# Altium schematic sheet Analog.SchDoc
size A4
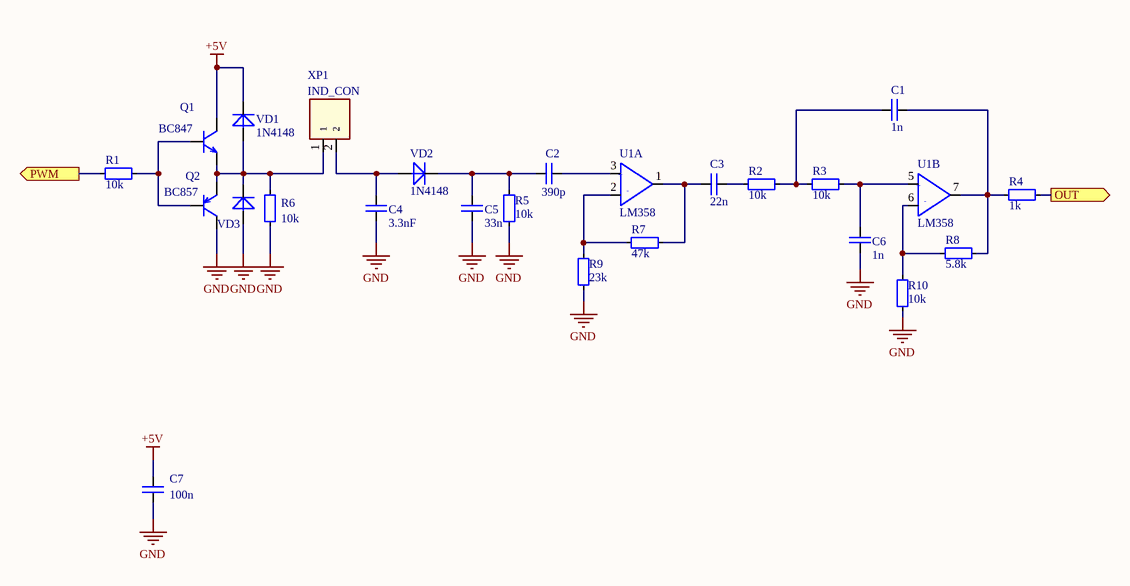
[diagram p0: Analog.SchDoc]

## Parts
C1  1n  [SMD_0805]
C2  390p  [SMD_0805]
C3  22n  [SMD_0805]
C4  3.3nF  [SMD_0805]
C5  33n  [SMD_0805]
C6  1n  [SMD_0805]
C7  100n  [SMD_0805]
Q1  BC847  [SOT23-3PIN]
Q2  BC857  [SOT23-3PIN]
R1  10k  [SMD_1206]
R2  10k  [SMD_0805]
R3  10k  [SMD_0805]
R4  1k  [SMD_1206]
R5  10k  [SMD_0805]
R6  10k  [SMD_0805]
R7  47k  [SMD_0805]
R8  5.8k  [SMD_0805]
R9  23k  [SMD_0805]
R10  10k  [SMD_0805]
U1  LM358  [SO8-150mil]  (parts A,B of 2)
VD1  1N4148  [DIO-MELF_SOD-80]
VD2  1N4148  [DIO-MELF_SOD-80]
VD3  1N4148  [DIO-MELF_SOD-80]  (value not drawn)
XP1  IND_CON  [PIN-HEAD-1/2/2.54]

## Ports
OUT (out), PWM (out)

## Nets
+5V: C7.2 Q1.3(C) U1.8(VCC) VD1.1(C)
GND: C4.1 C5.1 C6.1 C7.1 Q2.3(C) R5.2 R6.2 R9.2 R10.2 U1.4(GND) VD3.2(A)
OUT: R4.1 ; port OUT
PWM: R1.1 ; port PWM
NetC1_1: C1.1 R2.1 R3.2
NetC1_2: C1.2 R4.2 R8.1 U1.7
NetC2_1: C2.1 C5.2 R5.1 VD2.1(C)
NetC2_2: C2.2 U1.3
NetC3_1: C3.1 R7.1 U1.1
NetC3_2: C3.2 R2.2
NetC4_2: C4.2 VD2.2(A) XP1.2
NetC6_2: C6.2 R3.1 U1.5
NetQ1_1: Q1.1(B) Q2.1(B) R1.2
NetQ1_2: Q1.2(E) Q2.2(E) R6.1 VD1.2(A) VD3.1(C) XP1.1
NetR7_2: R7.2 R9.1 U1.2
NetR8_2: R8.2 R10.1 U1.6

## Notes on the sheet
- (in symbol LM358, part A) +; -
- (in symbol LM358, part B) +; -

## Library data of the parts
C1-C7 = C_NONE_POLAR: None polar capacitor; Case: 0805
  C1 C6: Value: 1n
  C2: Value: 390p
  C3: Value: 22n
  C4: Value: 3.3nF
  C5: Value: 33n
  C7: Value: 100n
Q1 = BC847: NPN; Manufacture: NXP; Model: BC847; Case: SOT-23; HelpURL: https://assets.nexperia.com/documents/data-sheet/BC847_SER.pdf
Q2 = BC857: PNP; Manufacture: NXP; Model: BC857; Case: SOT-23; HelpURL: https://assets.nexperia.com/documents/data-sheet/BC856_BC857_BC858.pdf
R1-R10 = RES: Resistor; Case: 0805
  R1-R3 R5 R6 R10: Value: 10k
  R4: Value: 1k
  R7: Value: 47k
  R8: Value: 5.8k
  R9: Value: 23k
U1 = LM358: OpAmp; Manufacture: TI; Case: SOIC-8; HelpURL: http://www.ti.com/lit/ds/symlink/lm158-n.pdf; Model: LM358
VD1-VD3 = DIODE: Value: 1N4148
  VD1 VD3: Case: *
  VD2: Case: 0805
XP1 = CON_2